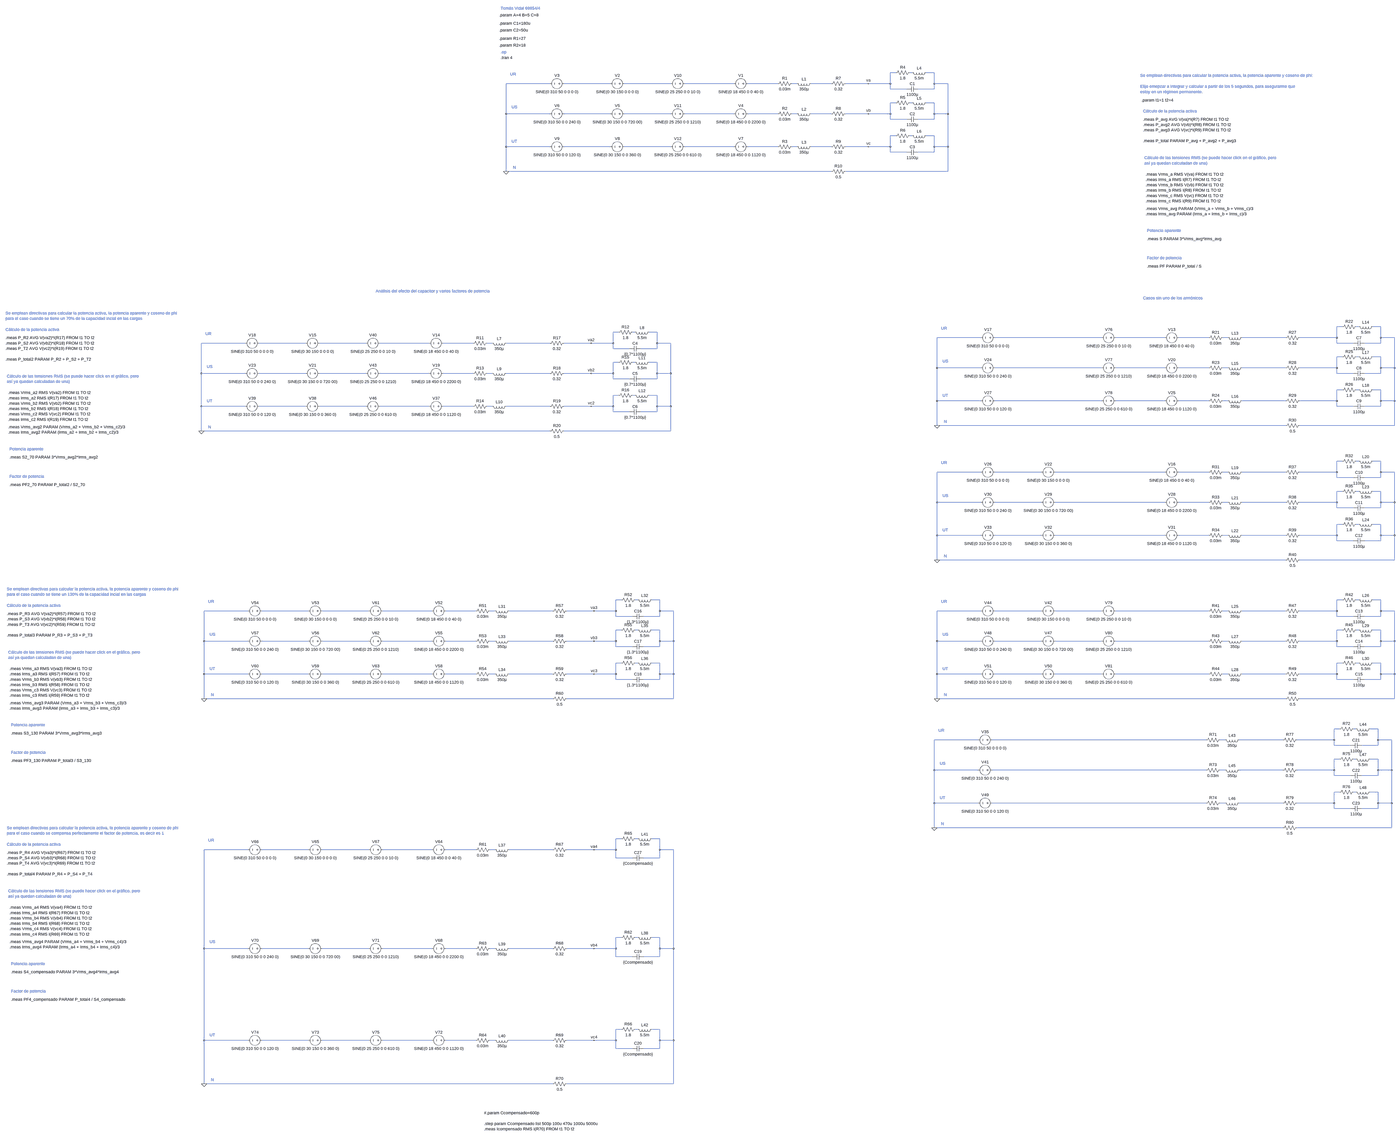
[diagram p0: schematic Problema1.asc, whole sheet]
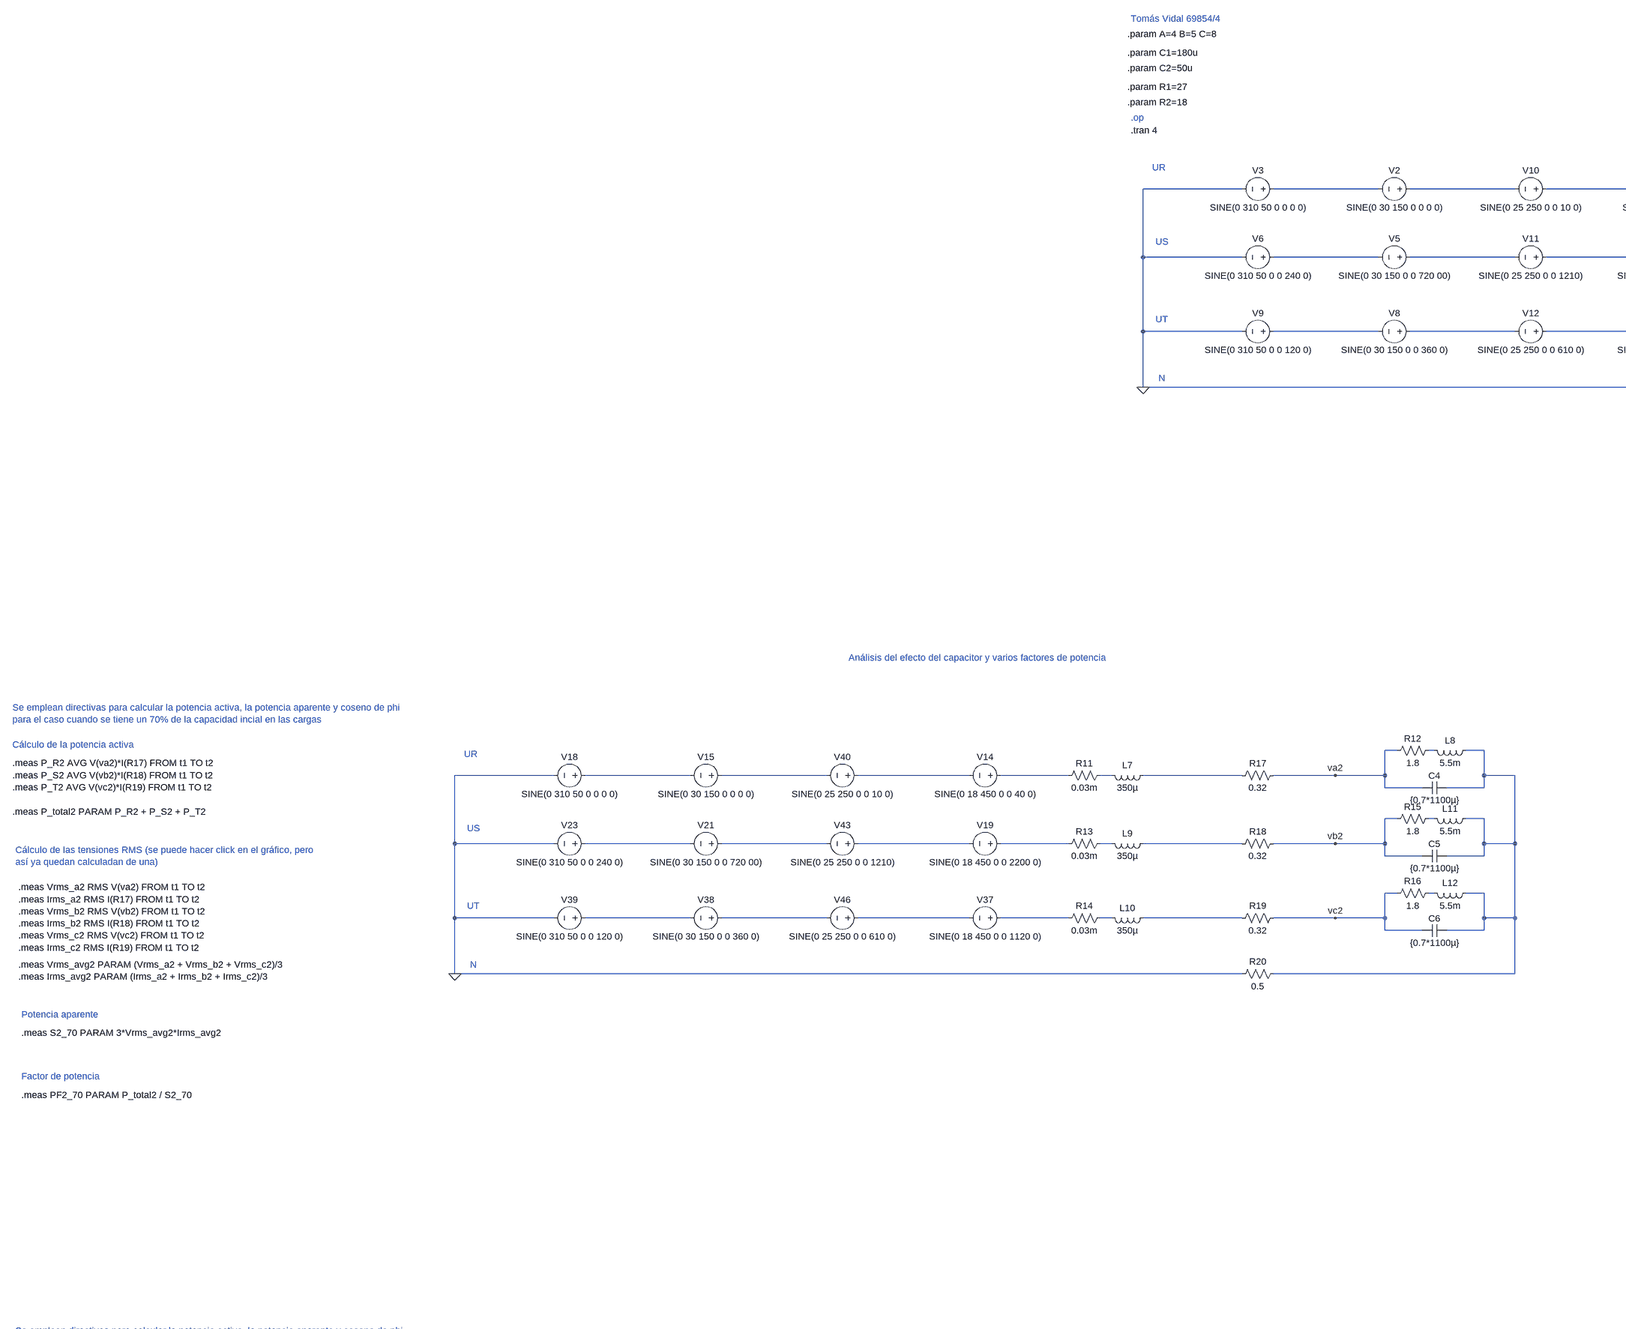
[diagram p1: schematic Problema1.asc, part, row 1 of 2, column 1 of 2]
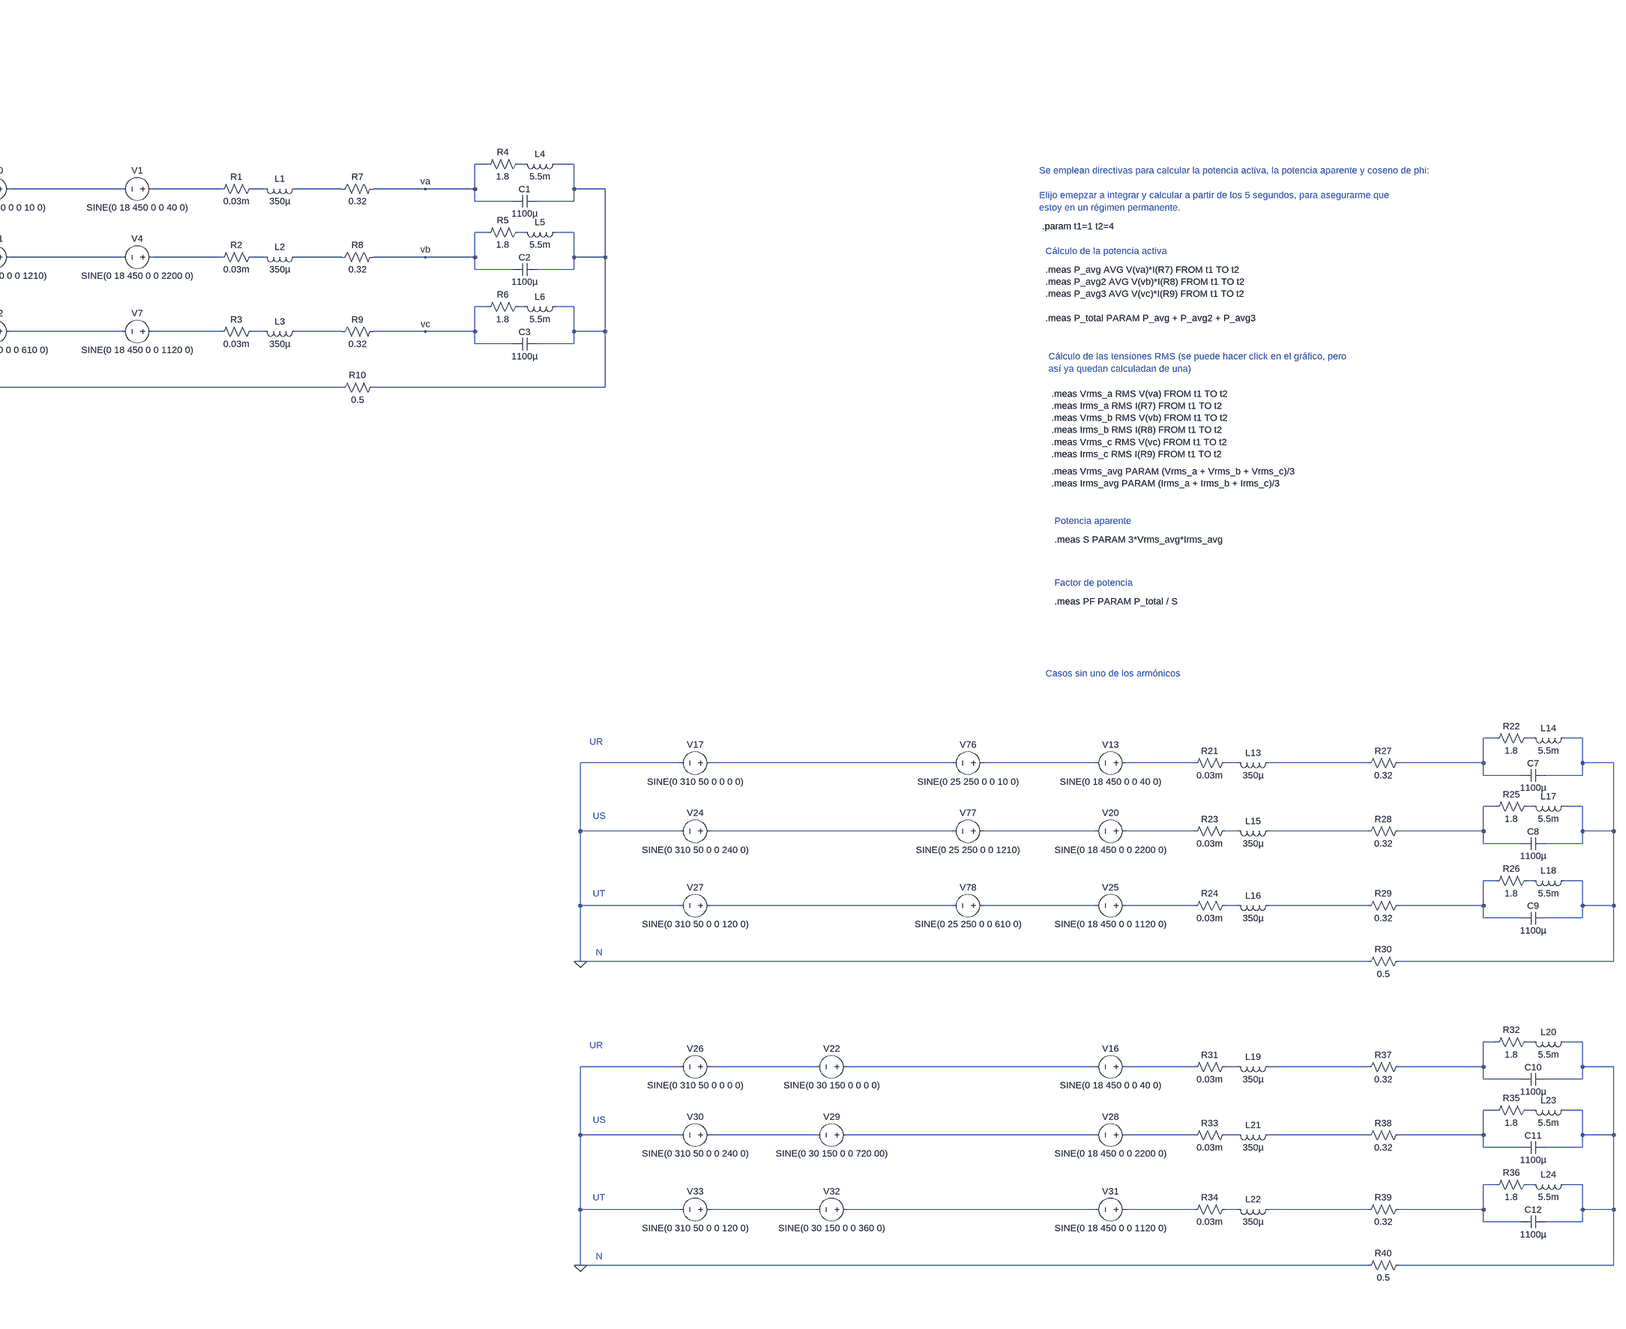
[diagram p2: schematic Problema1.asc, part, row 1 of 2, column 2 of 2]
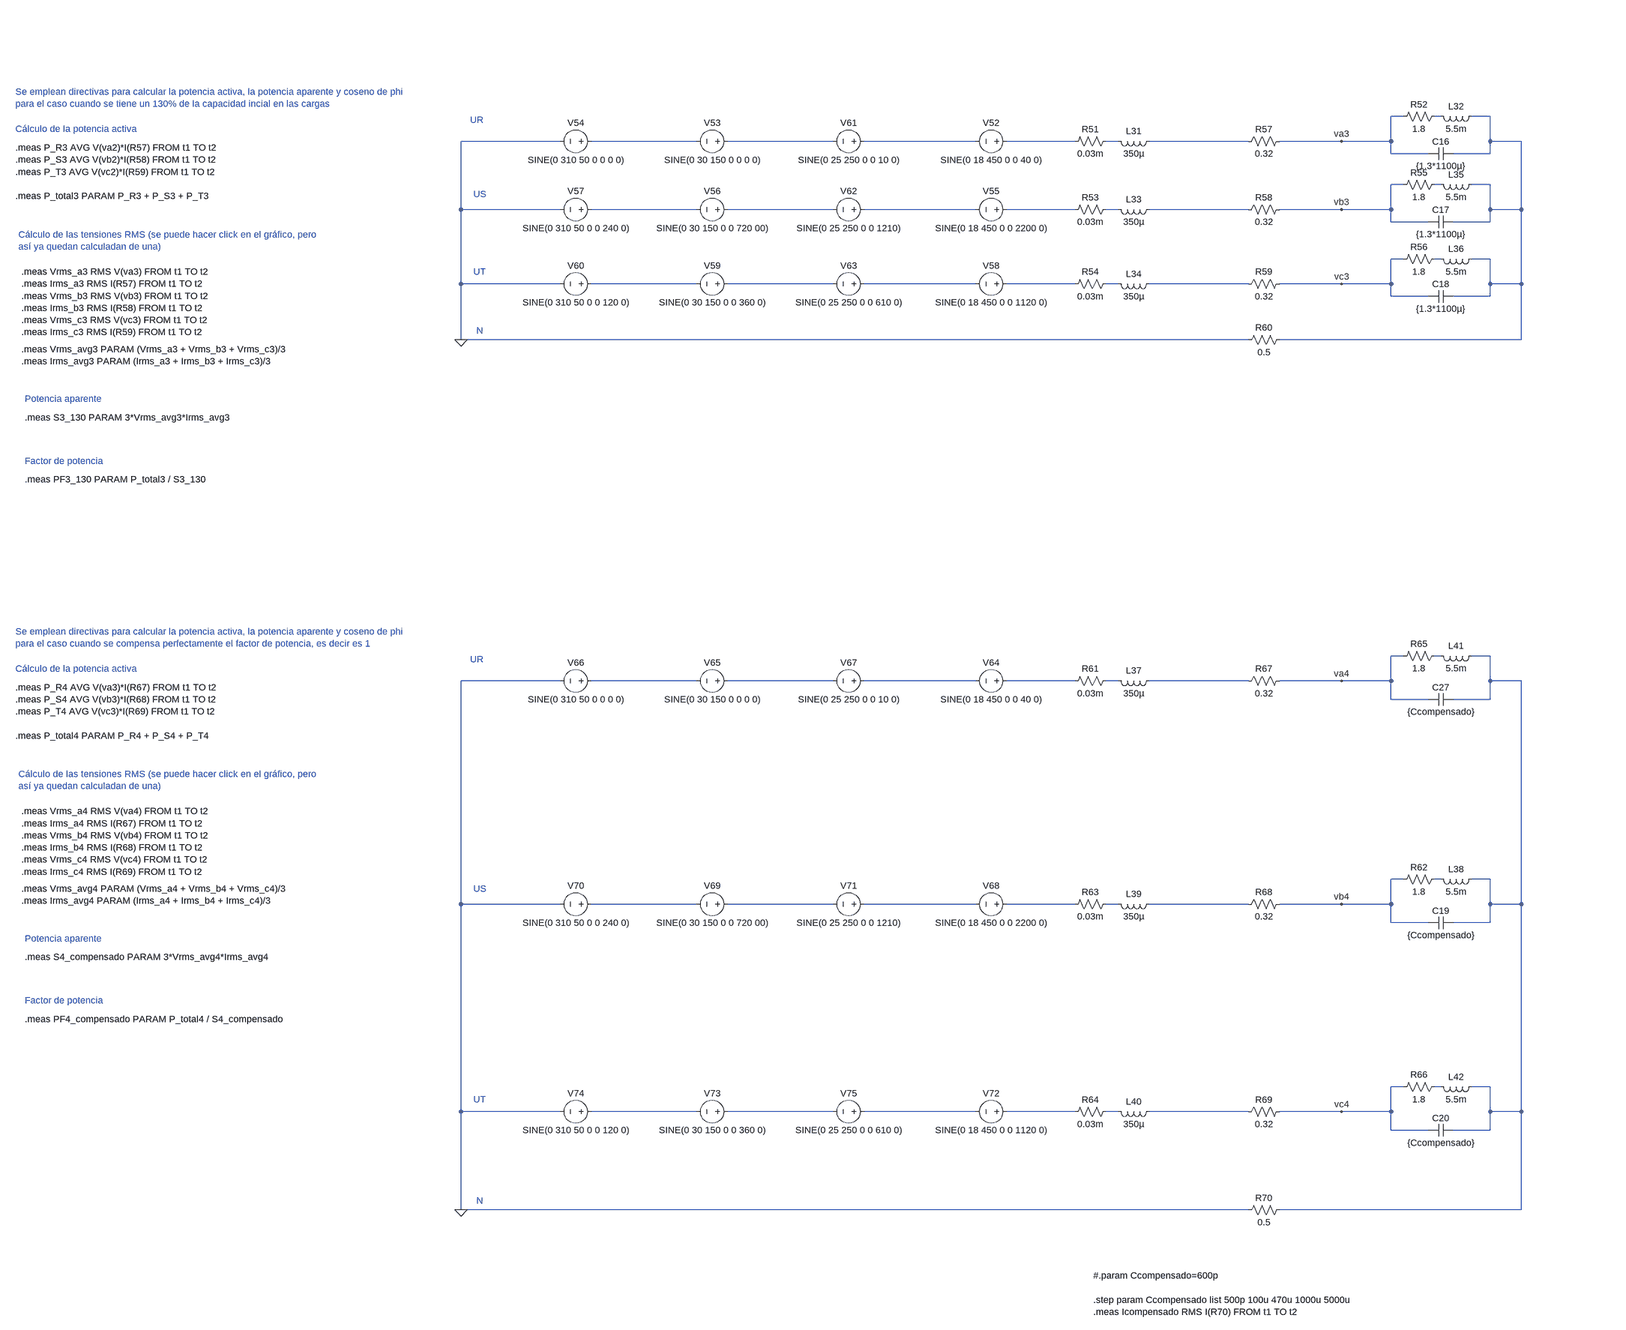
[diagram p3: schematic Problema1.asc, part, row 2 of 2, column 1 of 2]
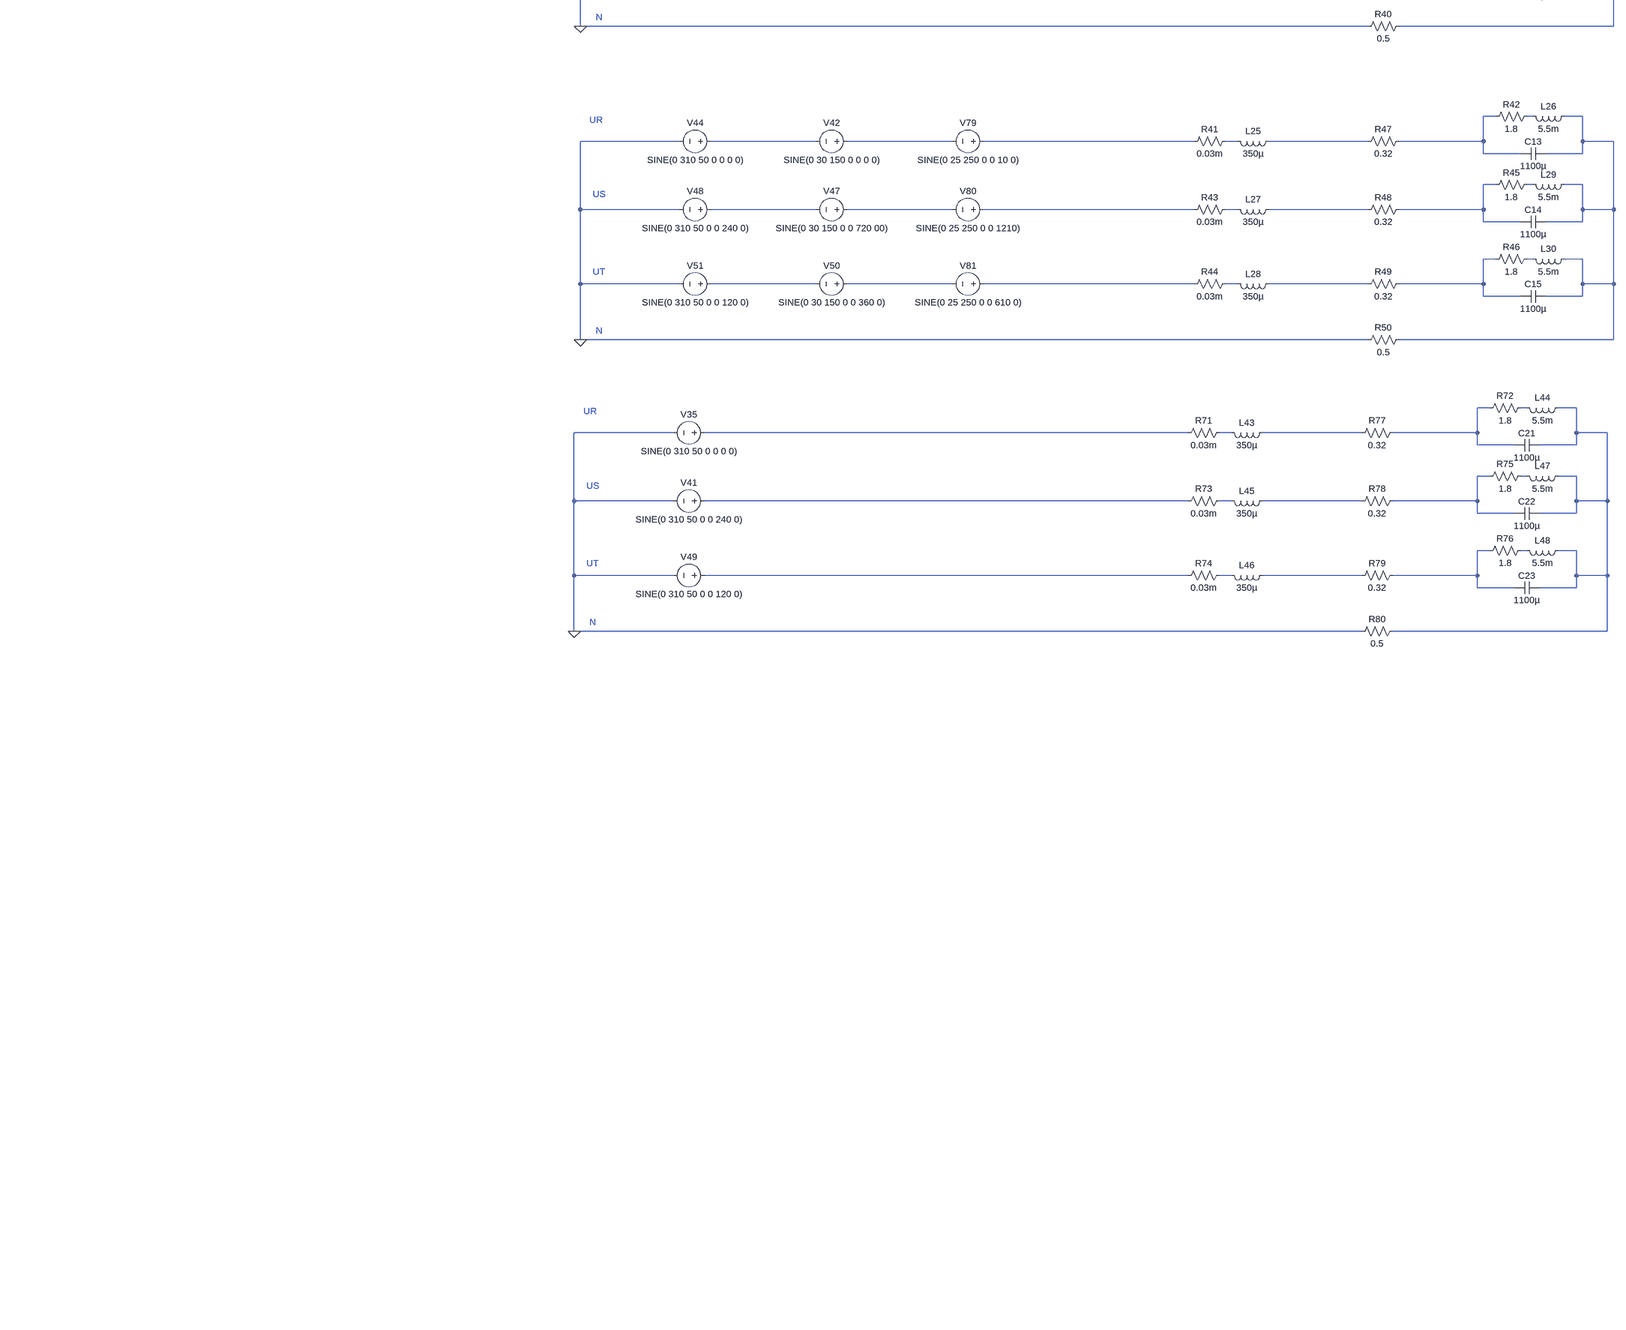
[diagram p4: schematic Problema1.asc, part, row 2 of 2, column 2 of 2]
* Problema1.asc
R1 N007 N006 0.03m
L1 N008 N007 350µ
C1 N002 va 1100µ
R4 N001 va 1.8
L4 N002 N001 5.5m
R2 N014 N013 0.03m
L2 N015 N014 350µ
R3 N021 N020 0.03m
L3 N022 N021 350µ
C2 N002 vb 1100µ
R5 N009 vb 1.8
L5 N002 N009 5.5m
C3 N002 vc 1100µ
R6 N016 vc 1.8
L6 N002 N016 5.5m
R7 N008 va 0.32
R8 N015 vb 0.32
R9 N022 vc 0.32
R10 N002 0 0.5
R21 N031 N030 0.03m
L13 N032 N031 350µ
C7 N025 N023 1100µ
R22 N024 N023 1.8
L14 N025 N024 5.5m
R23 N045 N044 0.03m
L15 N046 N045 350µ
R24 N059 N058 0.03m
L16 N060 N059 350µ
C8 N025 N039 1100µ
R25 N040 N039 1.8
L17 N025 N040 5.5m
C9 N025 N053 1100µ
R26 N054 N053 1.8
L18 N025 N054 5.5m
R27 N023 N032 0.32
R28 N039 N046 0.32
R29 N053 N060 0.32
R30 N025 0 0.5
R31 N073 N072 0.03m
L19 N074 N073 350µ
C10 N069 N067 1100µ
R32 N068 N067 1.8
L20 N069 N068 5.5m
R33 N080 N079 0.03m
L21 N081 N080 350µ
R34 N087 N086 0.03m
L22 N088 N087 350µ
C11 N069 N075 1100µ
R35 N076 N075 1.8
L23 N069 N076 5.5m
C12 N069 N082 1100µ
R36 N083 N082 1.8
L24 N069 N083 5.5m
R37 N067 N074 0.32
R38 N075 N081 0.32
R39 N082 N088 0.32
R40 N069 0 0.5
R41 N103 N102 0.03m
L25 N104 N103 350µ
C13 N093 N091 1100µ
R42 N092 N091 1.8
L26 N093 N092 5.5m
R43 N117 N116 0.03m
L27 N118 N117 350µ
R44 N131 N130 0.03m
L28 N132 N131 350µ
C14 N093 N106 1100µ
R45 N107 N106 1.8
L29 N093 N107 5.5m
C15 N093 N120 1100µ
R46 N121 N120 1.8
L30 N093 N121 5.5m
R47 N091 N104 0.32
R48 N106 N118 0.32
R49 N120 N132 0.32
R50 N093 0 0.5
R11 N037 N036 0.03m
L7 N038 N037 350µ
C4 N027 va2 {0.7*1100µ}
R12 N026 va2 1.8
L8 N027 N026 5.5m
V14 N036 N035 SINE(0 18 450 0 0 40 0)
V15 N034 N033 SINE(0 30 150 0 0 0 0)
V18 N033 0 SINE(0 310 50 0 0 0 0)
V19 N050 N049 SINE(0 18 450 0 0 2200 0)
V21 N048 N047 SINE(0 30 150 0 0 720 00)
V23 N047 0 SINE(0 310 50 0 0 240 0)
V37 N064 N063 SINE(0 18 450 0 0 1120 0)
V38 N062 N061 SINE(0 30 150 0 0 360 0)
V39 N061 0 SINE(0 310 50 0 0 120 0)
R13 N051 N050 0.03m
L9 N052 N051 350µ
R14 N065 N064 0.03m
L10 N066 N065 350µ
R15 N041 vb2 1.8
L11 N027 N041 5.5m
R16 N055 vc2 1.8
L12 N027 N055 5.5m
R17 N038 va2 0.32
R18 N052 vb2 0.32
R19 N066 vc2 0.32
R20 N027 0 0.5
V40 N035 N034 SINE(0 25 250 0 0 10 0)
V43 N049 N048 SINE(0 25 250 0 0 1210)
V46 N063 N062 SINE(0 25 250 0 0 610 0)
C5 N027 vb2 {0.7*1100µ}
C6 N027 vc2 {0.7*1100µ}
R51 N098 N097 0.03m
L31 N099 N098 350µ
C16 N090 va3 {1.3*1100µ}
R52 N089 va3 1.8
L32 N090 N089 5.5m
R53 N112 N111 0.03m
L33 N113 N112 350µ
R54 N126 N125 0.03m
L34 N127 N126 350µ
R55 N105 vb3 1.8
L35 N090 N105 5.5m
R56 N119 vc3 1.8
L36 N090 N119 5.5m
R57 N099 va3 0.32
R58 N113 vb3 0.32
R59 N127 vc3 0.32
R60 N090 0 0.5
C17 N090 vb3 {1.3*1100µ}
C18 N090 vc3 {1.3*1100µ}
R61 N155 N154 0.03m
L37 N156 N155 350µ
R63 N162 N161 0.03m
L39 N163 N162 350µ
R64 N169 N168 0.03m
L40 N170 N169 350µ
R67 N156 va4 0.32
R68 N163 vb4 0.32
R69 N170 vc4 0.32
R70 N150 0 0.5
R65 N149 va4 1.8
L41 N150 N149 5.5m
C27 N150 va4 {Ccompensado}
R62 N157 vb4 1.8
L38 N150 N157 5.5m
C19 N150 vb4 {Ccompensado}
R66 N164 vc4 1.8
L42 N150 N164 5.5m
C20 N150 vc4 {Ccompensado}
V1 N006 N005 SINE(0 18 450 0 0 40 0)
V2 N004 N003 SINE(0 30 150 0 0 0 0)
V3 N003 0 SINE(0 310 50 0 0 0 0)
V4 N013 N012 SINE(0 18 450 0 0 2200 0)
V5 N011 N010 SINE(0 30 150 0 0 720 00)
V6 N010 0 SINE(0 310 50 0 0 240 0)
V7 N020 N019 SINE(0 18 450 0 0 1120 0)
V8 N018 N017 SINE(0 30 150 0 0 360 0)
V9 N017 0 SINE(0 310 50 0 0 120 0)
V10 N005 N004 SINE(0 25 250 0 0 10 0)
V11 N012 N011 SINE(0 25 250 0 0 1210)
V12 N019 N018 SINE(0 25 250 0 0 610 0)
V52 N097 N096 SINE(0 18 450 0 0 40 0)
V53 N095 N094 SINE(0 30 150 0 0 0 0)
V54 N094 0 SINE(0 310 50 0 0 0 0)
V55 N111 N110 SINE(0 18 450 0 0 2200 0)
V56 N109 N108 SINE(0 30 150 0 0 720 00)
V57 N108 0 SINE(0 310 50 0 0 240 0)
V58 N125 N124 SINE(0 18 450 0 0 1120 0)
V59 N123 N122 SINE(0 30 150 0 0 360 0)
V60 N122 0 SINE(0 310 50 0 0 120 0)
V61 N096 N095 SINE(0 25 250 0 0 10 0)
V62 N110 N109 SINE(0 25 250 0 0 1210)
V63 N124 N123 SINE(0 25 250 0 0 610 0)
V64 N154 N153 SINE(0 18 450 0 0 40 0)
V65 N152 N151 SINE(0 30 150 0 0 0 0)
V66 N151 0 SINE(0 310 50 0 0 0 0)
V67 N153 N152 SINE(0 25 250 0 0 10 0)
V68 N161 N160 SINE(0 18 450 0 0 2200 0)
V69 N159 N158 SINE(0 30 150 0 0 720 00)
V70 N158 0 SINE(0 310 50 0 0 240 0)
V71 N160 N159 SINE(0 25 250 0 0 1210)
V72 N168 N167 SINE(0 18 450 0 0 1120 0)
V73 N166 N165 SINE(0 30 150 0 0 360 0)
V74 N165 0 SINE(0 310 50 0 0 120 0)
V75 N167 N166 SINE(0 25 250 0 0 610 0)
V13 N030 N029 SINE(0 18 450 0 0 40 0)
V17 N028 0 SINE(0 310 50 0 0 0 0)
V20 N044 N043 SINE(0 18 450 0 0 2200 0)
V24 N042 0 SINE(0 310 50 0 0 240 0)
V25 N058 N057 SINE(0 18 450 0 0 1120 0)
V27 N056 0 SINE(0 310 50 0 0 120 0)
V76 N029 N028 SINE(0 25 250 0 0 10 0)
V77 N043 N042 SINE(0 25 250 0 0 1210)
V78 N057 N056 SINE(0 25 250 0 0 610 0)
V16 N072 N071 SINE(0 18 450 0 0 40 0)
V22 N071 N070 SINE(0 30 150 0 0 0 0)
V26 N070 0 SINE(0 310 50 0 0 0 0)
V28 N079 N078 SINE(0 18 450 0 0 2200 0)
V29 N078 N077 SINE(0 30 150 0 0 720 00)
V30 N077 0 SINE(0 310 50 0 0 240 0)
V31 N086 N085 SINE(0 18 450 0 0 1120 0)
V32 N085 N084 SINE(0 30 150 0 0 360 0)
V33 N084 0 SINE(0 310 50 0 0 120 0)
V42 N101 N100 SINE(0 30 150 0 0 0 0)
V44 N100 0 SINE(0 310 50 0 0 0 0)
V47 N115 N114 SINE(0 30 150 0 0 720 00)
V48 N114 0 SINE(0 310 50 0 0 240 0)
V50 N129 N128 SINE(0 30 150 0 0 360 0)
V51 N128 0 SINE(0 310 50 0 0 120 0)
V79 N102 N101 SINE(0 25 250 0 0 10 0)
V80 N116 N115 SINE(0 25 250 0 0 1210)
V81 N130 N129 SINE(0 25 250 0 0 610 0)
R71 N137 N136 0.03m
L43 N138 N137 350µ
C21 N135 N133 1100µ
R72 N134 N133 1.8
L44 N135 N134 5.5m
R73 N142 N141 0.03m
L45 N143 N142 350µ
R74 N147 N146 0.03m
L46 N148 N147 350µ
C22 N135 N139 1100µ
R75 N140 N139 1.8
L47 N135 N140 5.5m
C23 N135 N144 1100µ
R76 N145 N144 1.8
L48 N135 N145 5.5m
R77 N133 N138 0.32
R78 N139 N143 0.32
R79 N144 N148 0.32
R80 N135 0 0.5
V35 N136 0 SINE(0 310 50 0 0 0 0)
V41 N141 0 SINE(0 310 50 0 0 240 0)
V49 N146 0 SINE(0 310 50 0 0 120 0)
.param A=4 B=5 C=8
.param C1=180u
.param C2=50u
.param R1=27
.param R2=18
* .op
* Tomás Vidal 69854/4
.tran 4
* N
* N
* N
* Se emplean directivas para calcular la potencia activa, la potencia aparente y coseno de phi:
.meas P_avg AVG V(va)*I(R7) FROM t1 TO t2
.meas P_avg2 AVG V(vb)*I(R8) FROM t1 TO t2
.meas P_avg3 AVG V(vc)*I(R9) FROM t1 TO t2
.meas P_total PARAM P_avg + P_avg2 + P_avg3
.param t1=1 t2=4
* Elijo emepzar a integrar y calcular a partir de los 5 segundos, para asegurarme que
* estoy en un régimen permanente.
* Cálculo de la potencia activa
* Cálculo de las tensiones RMS (se puede hacer click en el gráfico, pero
* así ya quedan calculadan de una)
.meas Vrms_a RMS V(va) FROM t1 TO t2
.meas Irms_a RMS I(R7) FROM t1 TO t2
.meas Vrms_b RMS V(vb) FROM t1 TO t2
.meas Irms_b RMS I(R8) FROM t1 TO t2
.meas Vrms_c RMS V(vc) FROM t1 TO t2
.meas Irms_c RMS I(R9) FROM t1 TO t2
.meas Vrms_avg PARAM (Vrms_a + Vrms_b + Vrms_c)/3
.meas Irms_avg PARAM (Irms_a + Irms_b + Irms_c)/3
* Potencia aparente
.meas S PARAM 3*Vrms_avg*Irms_avg
* Factor de potencia
.meas PF PARAM P_total / S
* UR
* US
* UT
* N
* Casos sin uno de los armónicos
* Análisis del efecto del capacitor y varios factores de potencia
* Se emplean directivas para calcular la potencia activa, la potencia aparente y coseno de phi
* para el caso cuando se tiene un 70% de la capacidad incial en las cargas
.meas P_R2 AVG V(va2)*I(R17) FROM t1 TO t2
.meas P_S2 AVG V(vb2)*I(R18) FROM t1 TO t2
.meas P_T2 AVG V(vc2)*I(R19) FROM t1 TO t2
.meas P_total2 PARAM P_R2 + P_S2 + P_T2
* Cálculo de la potencia activa
* Cálculo de las tensiones RMS (se puede hacer click en el gráfico, pero
* así ya quedan calculadan de una)
.meas Vrms_a2 RMS V(va2) FROM t1 TO t2
.meas Irms_a2 RMS I(R17) FROM t1 TO t2
.meas Vrms_b2 RMS V(vb2) FROM t1 TO t2
.meas Irms_b2 RMS I(R18) FROM t1 TO t2
.meas Vrms_c2 RMS V(vc2) FROM t1 TO t2
.meas Irms_c2 RMS I(R19) FROM t1 TO t2
.meas Vrms_avg2 PARAM (Vrms_a2 + Vrms_b2 + Vrms_c2)/3
.meas Irms_avg2 PARAM (Irms_a2 + Irms_b2 + Irms_c2)/3
* Potencia aparente
.meas S2_70 PARAM 3*Vrms_avg2*Irms_avg2
* Factor de potencia
.meas PF2_70 PARAM P_total2 / S2_70
* Se emplean directivas para calcular la potencia activa, la potencia aparente y coseno de phi
* para el caso cuando se tiene un 130% de la capacidad incial en las cargas
.meas P_R3 AVG V(va2)*I(R57) FROM t1 TO t2
.meas P_S3 AVG V(vb2)*I(R58) FROM t1 TO t2
.meas P_T3 AVG V(vc2)*I(R59) FROM t1 TO t2
.meas P_total3 PARAM P_R3 + P_S3 + P_T3
* Cálculo de la potencia activa
* Cálculo de las tensiones RMS (se puede hacer click en el gráfico, pero
* así ya quedan calculadan de una)
.meas Vrms_a3 RMS V(va3) FROM t1 TO t2
.meas Irms_a3 RMS I(R57) FROM t1 TO t2
.meas Vrms_b3 RMS V(vb3) FROM t1 TO t2
.meas Irms_b3 RMS I(R58) FROM t1 TO t2
.meas Vrms_c3 RMS V(vc3) FROM t1 TO t2
.meas Irms_c3 RMS I(R59) FROM t1 TO t2
.meas Vrms_avg3 PARAM (Vrms_a3 + Vrms_b3 + Vrms_c3)/3
.meas Irms_avg3 PARAM (Irms_a3 + Irms_b3 + Irms_c3)/3
* Potencia aparente
.meas S3_130 PARAM 3*Vrms_avg3*Irms_avg3
* Factor de potencia
.meas PF3_130 PARAM P_total3 / S3_130
* N
* Se emplean directivas para calcular la potencia activa, la potencia aparente y coseno de phi
* para el caso cuando se compensa perfectamente el factor de potencia, es decir es 1
.meas P_R4 AVG V(va3)*I(R67) FROM t1 TO t2
.meas P_S4 AVG V(vb3)*I(R68) FROM t1 TO t2
.meas P_T4 AVG V(vc3)*I(R69) FROM t1 TO t2
.meas P_total4 PARAM P_R4 + P_S4 + P_T4
* Cálculo de la potencia activa
* Cálculo de las tensiones RMS (se puede hacer click en el gráfico, pero
* así ya quedan calculadan de una)
.meas Vrms_a4 RMS V(va4) FROM t1 TO t2
.meas Irms_a4 RMS I(R67) FROM t1 TO t2
.meas Vrms_b4 RMS V(vb4) FROM t1 TO t2
.meas Irms_b4 RMS I(R68) FROM t1 TO t2
.meas Vrms_c4 RMS V(vc4) FROM t1 TO t2
.meas Irms_c4 RMS I(R69) FROM t1 TO t2
.meas Vrms_avg4 PARAM (Vrms_a4 + Vrms_b4 + Vrms_c4)/3
.meas Irms_avg4 PARAM (Irms_a4 + Irms_b4 + Irms_c4)/3
* Potencia aparente
.meas S4_compensado PARAM 3*Vrms_avg4*Irms_avg4
* Factor de potencia
.meas PF4_compensado PARAM P_total4 / S4_compensado
#.param Ccompensado=600p
.step param Ccompensado list 500p 100u 470u 1000u 5000u
.meas Icompensado RMS I(R70) FROM t1 TO t2
* UR
* US
* UT
* N
* UR
* US
* UT
* N
* UR
* US
* UT
* UR
* US
* UT
* UR
* US
* UT
* UR
* US
* UT
* N
* UR
* US
* UT
.backanno
.end